# Altium schematic sheet CELL_BALANCE.SchDoc
size A4
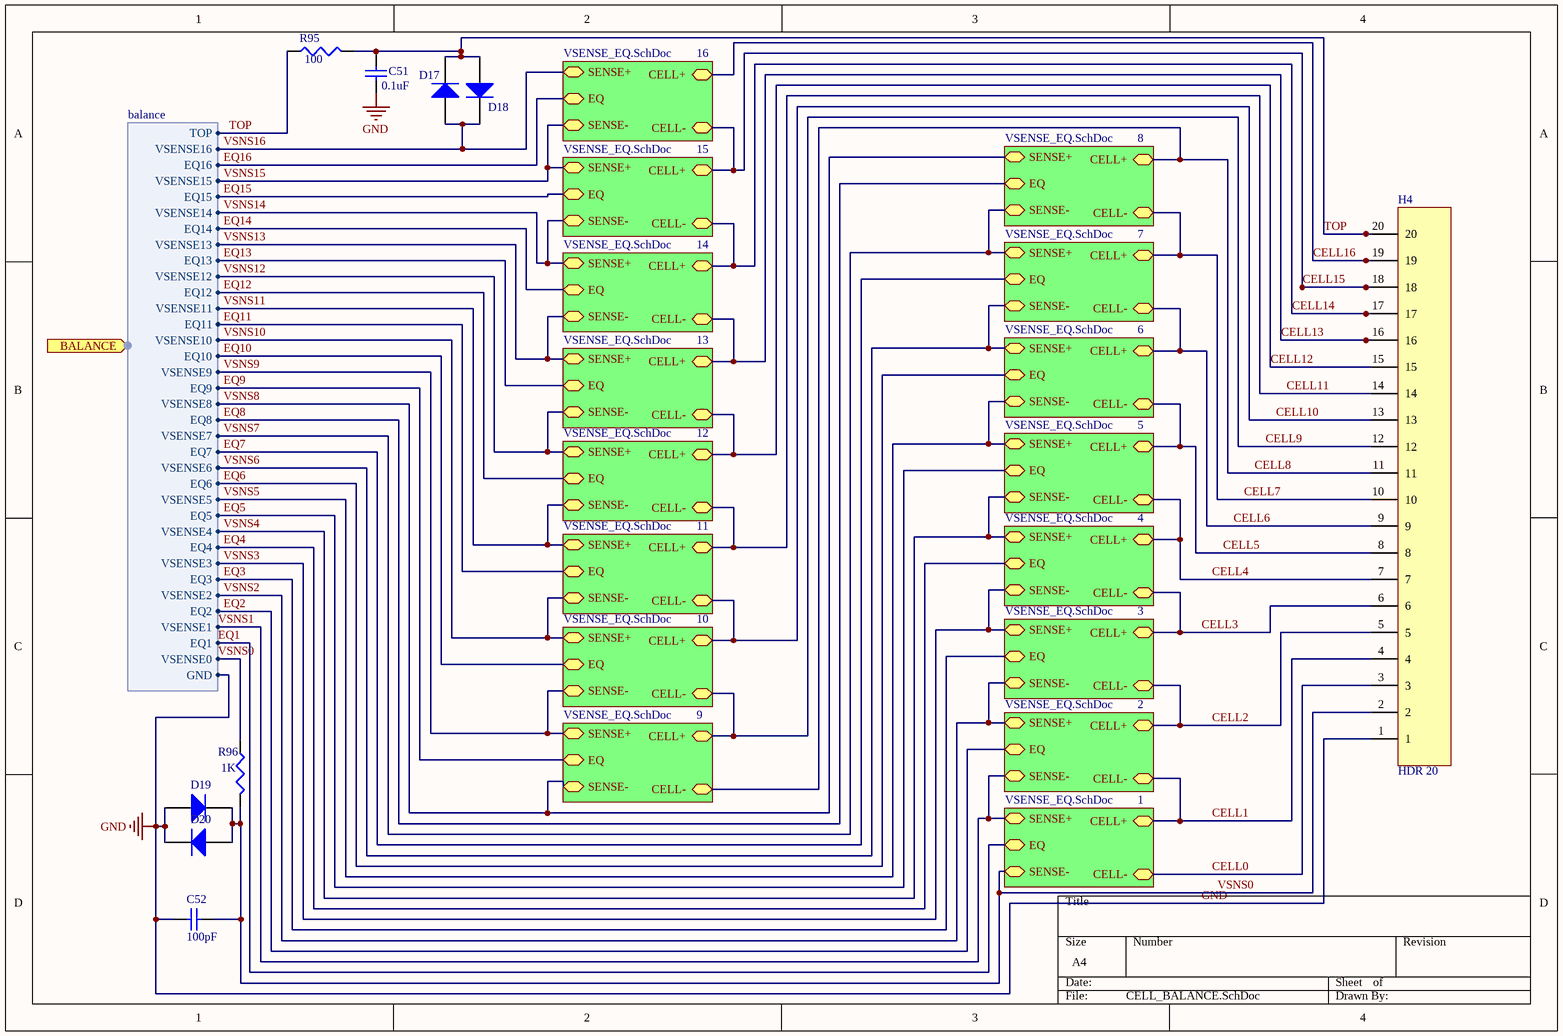
[diagram p0: CELL_BALANCE.SchDoc]

## Parts
C51  value 0.1uF  [1210 cap]  (hidden comment: Cap Semi)
C52  value 100pF  [0603 CAP]  (hidden comment: Cap Semi)
D17  (no value)  [DIODE BtoB]
D18  (no value)  [DIODE BtoB]
D19  (no value)  [DIODE BtoB]
D20  (no value)  [DIODE BtoB]
H4  HDR 20  [CELL HDR]
R95  value 100  [1206 RES]  (hidden comment: Res3)
R96  value 1K  [0603 RES]  (hidden comment: Res3)

## Sub-sheets
1 = VSENSE_EQ.SchDoc: SENSE+, CELL+, SENSE-, CELL-, EQ
2 = VSENSE_EQ.SchDoc: SENSE+, CELL+, SENSE-, CELL-, EQ
3 = VSENSE_EQ.SchDoc: SENSE+, CELL+, SENSE-, CELL-, EQ
4 = VSENSE_EQ.SchDoc: SENSE+, CELL+, SENSE-, CELL-, EQ
5 = VSENSE_EQ.SchDoc: SENSE+, CELL+, SENSE-, CELL-, EQ
6 = VSENSE_EQ.SchDoc: SENSE+, CELL+, SENSE-, CELL-, EQ
7 = VSENSE_EQ.SchDoc: SENSE+, CELL+, SENSE-, CELL-, EQ
8 = VSENSE_EQ.SchDoc: SENSE+, CELL+, SENSE-, CELL-, EQ
9 = VSENSE_EQ.SchDoc: SENSE+, CELL+, SENSE-, CELL-, EQ
10 = VSENSE_EQ.SchDoc: SENSE+, CELL+, SENSE-, CELL-, EQ
11 = VSENSE_EQ.SchDoc: SENSE+, CELL+, SENSE-, CELL-, EQ
12 = VSENSE_EQ.SchDoc: SENSE+, CELL+, SENSE-, CELL-, EQ
13 = VSENSE_EQ.SchDoc: SENSE+, CELL+, SENSE-, CELL-, EQ
14 = VSENSE_EQ.SchDoc: SENSE+, CELL+, SENSE-, CELL-, EQ
15 = VSENSE_EQ.SchDoc: SENSE+, CELL+, SENSE-, CELL-, EQ
16 = VSENSE_EQ.SchDoc: SENSE+, CELL+, SENSE-, CELL-, EQ

## Ports
BALANCE (harness balance)

## Harnesses
balance: GND, VSENSE0, EQ1, VSENSE1, EQ2, VSENSE2, EQ3, VSENSE3, EQ4, VSENSE4, EQ5, VSENSE5, EQ6, VSENSE6, EQ7, VSENSE7, EQ8, VSENSE8, EQ9, VSENSE9, EQ10, VSENSE10, EQ11, VSENSE11, EQ12, VSENSE12, EQ13, VSENSE13, EQ14, VSENSE14, EQ15, VSENSE15, EQ16, VSENSE16, TOP

## Nets
GND: C51.1 C52.1 D19.1(A) D20.2(K) H4.1 ; port BALANCE.GND
CELL0: H4.3 ; sheet 1/CELL-
CELL1: H4.4 ; sheet 2/CELL-, sheet 1/CELL+
CELL2: H4.5 ; sheet 3/CELL-, sheet 2/CELL+
CELL3: H4.6 ; sheet 4/CELL-, sheet 3/CELL+
CELL4: H4.7 ; sheet 4/CELL+, sheet 5/CELL-
CELL5: H4.8 ; sheet 5/CELL+, sheet 6/CELL-
CELL6: H4.9 ; sheet 6/CELL+, sheet 7/CELL-
CELL7: H4.10 ; sheet 7/CELL+, sheet 8/CELL-
CELL8: H4.11 ; sheet 8/CELL+, sheet 9/CELL-
CELL9: H4.12 ; sheet 10/CELL-, sheet 9/CELL+
CELL10: H4.13 ; sheet 11/CELL-, sheet 10/CELL+
CELL11: H4.14 ; sheet 12/CELL-, sheet 11/CELL+
CELL12: H4.15 ; sheet 12/CELL+, sheet 13/CELL-
CELL13: H4.16 ; sheet 13/CELL+, sheet 14/CELL-
CELL14: H4.17 ; sheet 14/CELL+, sheet 15/CELL-
CELL15: H4.18 ; sheet 15/CELL+, sheet 16/CELL-
CELL16: H4.19 ; sheet 16/CELL+
EQ1: sheet 1/EQ, port BALANCE.EQ1
EQ2: sheet 2/EQ, port BALANCE.EQ2
EQ3: sheet 3/EQ, port BALANCE.EQ3
EQ4: sheet 4/EQ, port BALANCE.EQ4
EQ5: sheet 5/EQ, port BALANCE.EQ5
EQ6: sheet 6/EQ, port BALANCE.EQ6
EQ7: sheet 7/EQ, port BALANCE.EQ7
EQ8: sheet 8/EQ, port BALANCE.EQ8
EQ9: sheet 9/EQ, port BALANCE.EQ9
EQ10: sheet 10/EQ, port BALANCE.EQ10
EQ11: sheet 11/EQ, port BALANCE.EQ11
EQ12: sheet 12/EQ, port BALANCE.EQ12
EQ13: sheet 13/EQ, port BALANCE.EQ13
EQ14: sheet 14/EQ, port BALANCE.EQ14
EQ15: sheet 15/EQ, port BALANCE.EQ15
EQ16: sheet 16/EQ, port BALANCE.EQ16
TOP: C51.2 D17.2(K) D18.1(A) H4.20 R95.1 R95.2 ; port BALANCE.TOP
VSNS0: C52.2 D19.2(K) D20.1(A) H4.2 R96.1 R96.2 ; sheet 1/SENSE-, port BALANCE.VSENSE0
VSNS1: sheet 2/SENSE-, sheet 1/SENSE+, port BALANCE.VSENSE1
VSNS2: sheet 3/SENSE-, sheet 2/SENSE+, port BALANCE.VSENSE2
VSNS3: sheet 4/SENSE-, sheet 3/SENSE+, port BALANCE.VSENSE3
VSNS4: sheet 4/SENSE+, sheet 5/SENSE-, port BALANCE.VSENSE4
VSNS5: sheet 5/SENSE+, sheet 6/SENSE-, port BALANCE.VSENSE5
VSNS6: sheet 6/SENSE+, sheet 7/SENSE-, port BALANCE.VSENSE6
VSNS7: sheet 7/SENSE+, sheet 8/SENSE-, port BALANCE.VSENSE7
VSNS8: sheet 8/SENSE+, sheet 9/SENSE-, port BALANCE.VSENSE8
VSNS9: sheet 10/SENSE-, sheet 9/SENSE+, port BALANCE.VSENSE9
VSNS10: sheet 11/SENSE-, sheet 10/SENSE+, port BALANCE.VSENSE10
VSNS11: sheet 12/SENSE-, sheet 11/SENSE+, port BALANCE.VSENSE11
VSNS12: sheet 12/SENSE+, sheet 13/SENSE-, port BALANCE.VSENSE12
VSNS13: sheet 13/SENSE+, sheet 14/SENSE-, port BALANCE.VSENSE13
VSNS14: sheet 14/SENSE+, sheet 15/SENSE-, port BALANCE.VSENSE14
VSNS15: sheet 15/SENSE+, sheet 16/SENSE-, port BALANCE.VSENSE15
VSNS16: D17.1(A) D18.2(K) ; sheet 16/SENSE+, port BALANCE.VSENSE16

## Library data of the parts
C51 = Cap Semi: Capacitor (Semiconductor SIM Model); Manufacturer: Murata; Manufacturer Part Number: GRM32NR72A104KA01L; Description: CAP CER 0.1UF 100V X7R 1210; Material: Ceramic; Capacitance: 100nF; Tolerance: 10%; Voltage Rating: 100V; Dielectric: X7R; Dissipation Factor: 0.05%; Published: 8-Jun-2000; LatestRevisionDate: 29-May-2009; LatestRevisionNote: IPC-7351 Footprint Added.; PackageReference: C1206; Publisher: Altium Limited; PackageDescription: Chip Capacitor; Supplier 1: Digi-Key; Supplier Part Number 1: 490-1853-1-ND; Stock 1: 0; Pricing 1: 1=0.86, 10=0.608, 100=0.4002, 500=0.2964, 1000=0.252 (USD); Mount: Surface Mount; Case/Package: 1210; Weight: 0.00388oz; Case Code (Metric): 3225; Case Code (Imperial): 1210; Dielectric Material: Ceramic; Min Operating Temperature: -55°C; Max Operating Temperature: 125°C; Package Quantity: 1; Packaging: Tape and Reel; Voltage Rating (DC): 100V; Termination: SMD/SMT; Voltage: 100V; Length: 3.2mm; Height: 1.35mm; Width: 2.5mm; Thickness: 0.059inch; Depth: 2.5mm; Radiation Hardening: No; Lead Free: Lead Free
C52 = Cap Semi: Capacitor (Semiconductor SIM Model); Manufacturer: TDK; Manufacturer Part Number: C1608X7R1C105K080AC; Description: TDK   C1608X7R1C105K080AC   CAPACITOR CERAMIC, 1UF, 16V, X7R, 10%, 0603; Dielectric Material: Ceramic; Tolerance: 10%; Capacitance: 1uF; Voltage Rating: 16V; Dielectric: X7R; Published: 8-Jun-2000; LatestRevisionDate: 29-May-2009; LatestRevisionNote: IPC-7351 Footprint Added.; PackageReference: C1206; Publisher: Altium Limited; PackageDescription: Chip Capacitor; Supplier 1: Digi-Key; Supplier Part Number 1: 445-1604-6-ND; Stock 1: 8000; Pricing 1: 1=0.12, 10=0.087, 100=0.0387, 500=0.0277, 1000=0.0217 (USD); Mount: Surface Mount; Case/Package: 0603; Weight: 7.1E-05oz; Case Code (Metric): 1608; Case Code (Imperial): 0603; Min Operating Temperature: -55°C; Max Operating Temperature: 125°C; Packaging: Tape and Reel; Package Quantity: 1; Termination: SMD/SMT; Voltage Rating (DC): 16V; Composition: Ceramic; Voltage: 16V; Length: 1.6mm; Height: 0.8mm; Width: 0.031inch; Thickness: 0.037inch; Depth: 0.8mm; Radiation Hardening: No; REACH SVHC: No SVHC; Lead Free: Lead Free
D17-D20 = Diode: Default Diode; Manufacturer: Diodes; Manufacturer Part Number: 1N4148W-7-F; Description: DIODE GEN PURP 100V 300MA SOD123; Max Surge Current: 2A; Forward Current: 150mA; Peak Reverse Current: 1uA; Recovery Time: 4ns; Forward Voltage: 1.25V; Average Rectified Current: 300mA; Max Repetitive Reverse Voltage (Vrrm): 100V; Power Dissipation: 400mW; Element Configuration: Single; Polarity: Standard; Voltage Rating (DC): 75V; Capacitance: 2pF; Current: 15A; Published: 8-Jun-2000; LatestRevisionDate: 17-Jul-2002; LatestRevisionNote: Re-released for DXP Platform.; PackageVersion: Sep-1996; PackageReference: SMC; Publisher: Altium Limited; PackageDescription: DO-214-AB/SMC; 2 C-Bend Leads; Body 7.9 x 5.9 mm, inc. leads (LxW); Code_JEDEC: DO-214-AB; Supplier 1: Digi-Key; Supplier Part Number 1: 1N4148W-FDICT-ND; Stock 1: 0; Pricing 1: 1=0.18, 10=0.164, 100=0.0891, 500=0.0548, 1000=0.0374 (USD); Mount: Surface Mount; Number of Pins: 2; Weight: 0.000353oz; Contact Plating: Matte,Tin; Min Operating Temperature: -65°C; Max Operating Temperature: 150°C; Package Quantity: 3000; Packaging: Tape and Reel; Reverse Recovery Time: 4ns; Peak Non-Repetitive Surge Current: 2A; Power Rating: 400mW; Max Reverse Voltage (DC): 100V; Max Forward Surge Current (Ifsm): 2A; Current Rating: 150mA; Output Current: 150mA; Voltage: 100V; Length: 2.85mm; Height: 1.25mm; Width: 1.7mm; Radiation Hardening: No; Lead Free: Lead Free; REACH SVHC: No SVHC
R95 = Res3: Resistor; Manufacturer: Vishay Dale; Manufacturer Part Number: CRCW1206100RFKEA; Description: Res Thick Film 1206 100 Ohm 1% 0.25W(1/4W) ±100ppm/C SMD Automotive Paper T/R; Resistance: 100R; Tolerance: 1%; Power Rating: 250mW; Voltage Rating: 200V; Temperature Coefficient: 100ppm/°C; Published: 8-Jun-2000; LatestRevisionDate: 29-May-2009; LatestRevisionNote: IPC-7351 Footprint Added.; PackageReference: J1-0603; Publisher: Altium Limited; PackageDescription: Chip Resistor; Supplier 1: Digi-Key; Supplier Part Number 1: 541-100FCT-ND; Stock 1: 0; Pricing 1: 1=0.1, 10=0.075, 100=0.0304, 1000=0.0136, 2500=0.0118 (USD); Mount: Surface Mount; Case/Package: 1206; Number of Pins: 2; Weight: 0.000353oz; Case Code (Imperial): 1206; Case Code (Metric): 3216; Contact Plating: Tin; Min Operating Temperature: -55°C; Max Operating Temperature: 155°C; Packaging: Tape and Reel; Package Quantity: 5000; Composition: Thick Film; Termination: SMD/SMT; Military Standard: Not; Voltage Rating (DC): 200V; Length: 3.2mm; Height: 0.55mm; Width: 1.6mm; Depth: 1.6mm; Radiation Hardening: No; REACH SVHC: Unknown; Lead Free: Lead Free
R96 = Res3: Resistor; Manufacturer: Vishay Dale; Manufacturer Part Number: CRCW06031K00FKEA; Description: RES SMD 1K OHM 1% 1/10W 0603; Resistance: 1kR; Power Rating: 100mW; Tolerance: 1%; Voltage Rating: 75V; Temperature Coefficient: 100ppm/°C; Published: 8-Jun-2000; LatestRevisionDate: 29-May-2009; LatestRevisionNote: IPC-7351 Footprint Added.; PackageReference: J1-0603; Publisher: Altium Limited; PackageDescription: Chip Resistor; Supplier 1: Digi-Key; Supplier Part Number 1: 541-1.00KHCT-ND; Stock 1: 0; Pricing 1: 1=0.1, 10=0.042, 100=0.017, 1000=0.0076, 2500=0.0066 (USD); Mount: Surface Mount; Case/Package: 0603; Number of Pins: 2; Weight: 7.1E-05oz; Case Code (Metric): 1608; Case Code (Imperial): 0603; Contact Plating: Tin; Min Operating Temperature: -55°C; Max Operating Temperature: 155°C; Composition: Thick Film; Packaging: Tape and Reel; Package Quantity: 10; Number of Terminations: 2; Termination: SMD/SMT; Military Standard: Not; Max Power Dissipation: 100mW; Voltage Rating (DC): 75V; Features: Automotive AEC-Q200; Length: 1.55mm; Height: 0.45mm; Width: 0.033inch; Depth: 0.85mm; Radiation Hardening: No; REACH SVHC: Unknown; Lead Free: Lead Free